# Altium schematic sheet RCar_Receiver.SchDoc
size A4; SheetNumber: 1; SheetTotal: 1
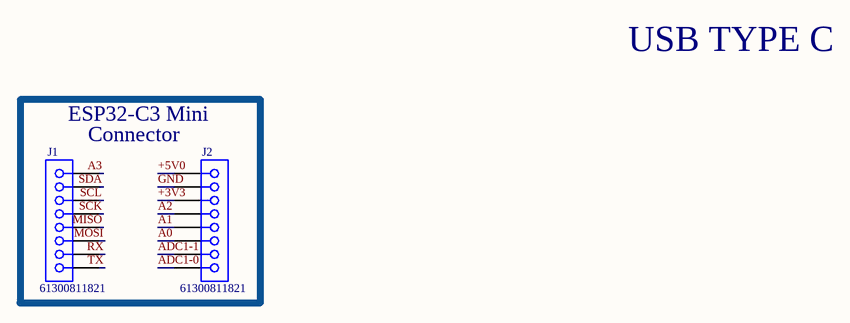
[diagram p0: RCar_Receiver.SchDoc]

## Parts
J1  61300811821  [61300811821]
J2  61300811821  [61300811821]

## Nets
+3V3: J2.3
+5V0: J2.1
A0: J2.6
A1: J2.5
A2: J2.4
A3: J1.1
ADC1-0: J2.8
ADC1-1: J2.7
GND: J2.2
MISO: J1.5
MOSI: J1.6
RX: J1.7
SCK: J1.4
SCL: J1.3
SDA: J1.2
TX: J1.8

## Notes on the sheet
- USB TYPE C
- ESP32-C3 Mini
- Connector

## Library data of the parts
J1 J2 = CMP-1502-01327-3: NexarPartId: 61924723; Current Rating: 3A; Gender: Female; Contact Resistance: 20mΩ; Operating Supply Voltage: 250V; Lead Pitch: 2.54mm; RoHS: Non-Compliant; Orientation: Vertical; Number of Pins: 8